# Altium schematic sheet [05] PCB_Mech.SchDoc: PCB marking & mechanical parts
size A4; Engineer: M. Folejewski; DocumentNumber: 5; SheetNumber: 5; SheetTotal: 5; PageSize: A4; Designators: 950-999
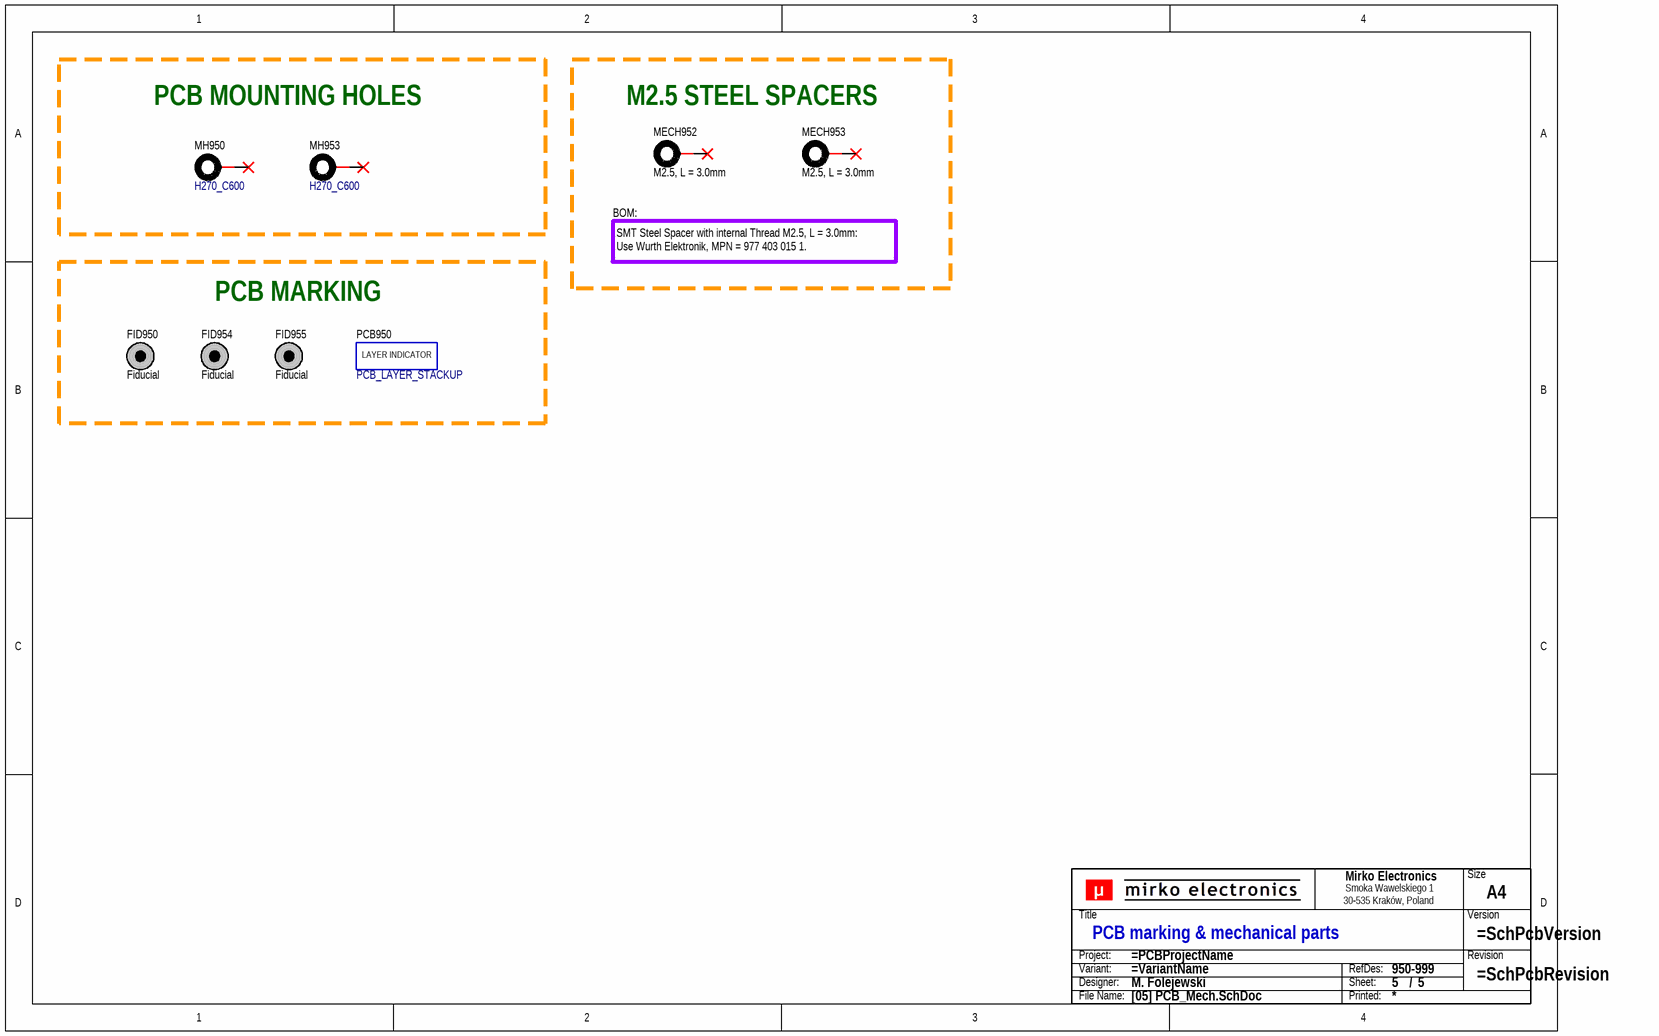
[diagram p0: [05] PCB_Mech.SchDoc]

## Parts
FID950  Fiducial  [PCB_FID_RND_100x300]  (no BOM)
FID954  Fiducial  [PCB_FID_RND_100x300]  (no BOM)
FID955  Fiducial  [PCB_FID_RND_100x300]  (no BOM)
MECH952  M2.5, L = 3.0mm  [PCB_WRT_9774030151]
MECH953  M2.5, L = 3.0mm  [PCB_WRT_9774030151]
MH950  H270_C600  [PCB_MH_H270_C600]  (no BOM)
MH953  H270_C600  [PCB_MH_H270_C600]  (no BOM)
PCB950  PCB_LAYER_STACKUP  [PCB_STACKUP-2L_A1]  (no BOM)
TB?  Title block  (value not drawn)  (graphical)

## Nets

Not connected (* = marked no-connect by the designer): MECH952 1*; MECH953 1*; MH950 1*; MH953 1*

## Notes on the sheet
- PCB MOUNTING HOLES
- M2.5 STEEL SPACERS
- BOM:
- PCB MARKING
- SMT Steel Spacer with internal Thread M2.5, L = 3.0mm:
  Use Wurth Elektronik, MPN = 977 403 015 1.
- (in symbol PCB_LAYER_STACKUP) LAYER INDICATOR
- (in symbol SCH_TITLE_BLOCK_V1) Mirko Electronics; Size; Smoka Wawelskiego 1; 30-535 Kraków, Poland; Title; Version; Project:; Revision; Variant:; RefDes:; Designer:; Sheet:; /; File Name:; Printed:

## Library data of the parts
FID950 FID954 FID955 = PCB_FID_RND: PCB Marking; Fiducial; Round;; Value: Fiducial; Component Subtype: -; Component Type: Fiducial; Mounting Type: -; Supplier: ?
MECH952 MECH953 = PCB_MECH_WRT_WA-SMSI: PCB; Mechanical; SMT Steel Spacer; M2.5;; Manufacturer: Wurth Elektronik; MPN: 977 403 015 1; Component Subtype: SMD Spacer; Package (Case): SMD; Value: M2.5, L = 3.0mm; Component Type: Spacer (Standoff); Mounting Type: SMD; Supplier: Wurth Elektronik
MH950 MH953 = PCB_MECH_MH: PCB Marking; Mounting hole;; Component Subtype: -; Component Type: Mounting Hole; Mounting Type: -; Supplier: ?
TB? = SCH_TITLE_BLOCK_V1: Component Type: Title block; Manufacturer: -; Mounting Type: Non component; MPN: -; Operating Temperature: -; Package: -; Specification: Title block; Value: Title block; Replacement: -; System: ?
PCB950 = PCB_LAYER_STACKUP: Component Subtype: -; Component Type: PCB Marking; Mounting Type: -; Supplier: ?